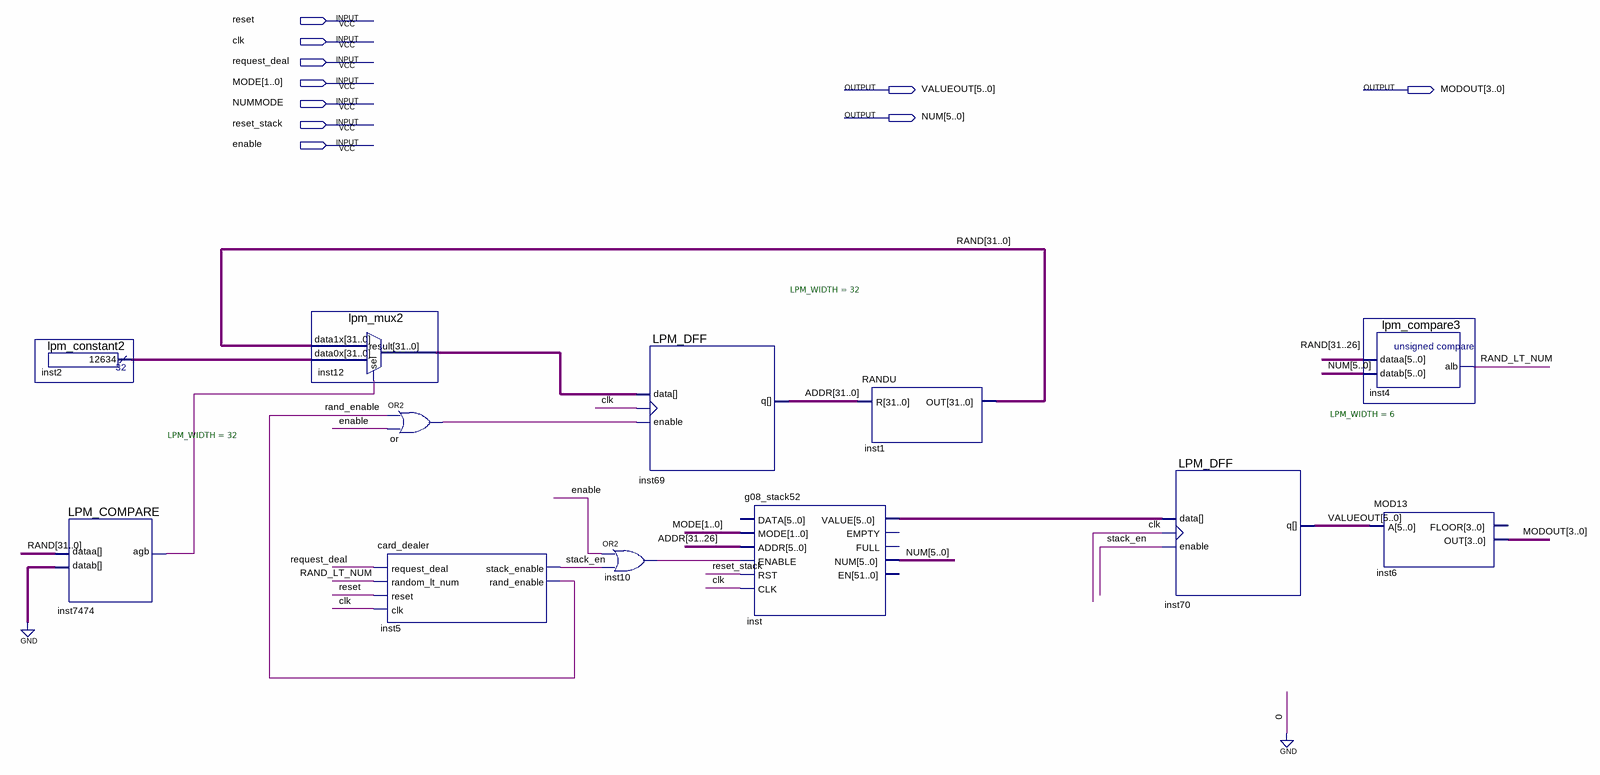
[diagram p0: schematic sheet]
// Quartus schematic test_bed_lab4.bdf as structural Verilog: 12 symbols, 10 pins
module test_bed_lab4 (
  input  reset,
  input  clk,
  input  request_deal,
  input  [1:0] MODE,
  input  NUMMODE,
  input  reset_stack,
  input  enable,
  output [5:0] VALUEOUT,
  output [3:0] MODOUT,
  output [5:0] NUM
);

  wire inst10_out, inst7474_agb, or_out, rand_enable, RAND_LT_NUM, stack_en;
  wire [5:0] inst_value;
  wire [31:0] ADDR, inst2_result, inst12_result, RAND;

  lpm_constant2 inst2 (.result(inst2_result));
  LPM_COMPARE #(.LPM_WIDTH(32)) inst7474 (.dataa(RAND), .datab({32{1'b0}}), .agb(inst7474_agb));
  lpm_mux2 inst12 (.data1x(RAND), .data0x(inst2_result), .sel(inst7474_agb), .result(inst12_result));
  or \or  (or_out, rand_enable, enable);
  card_dealer inst5 (
    .request_deal(request_deal), .random_lt_num(RAND_LT_NUM), .reset(reset), .clk(clk),
    .stack_enable(stack_en), .rand_enable(rand_enable));
  or inst10 (inst10_out, enable, stack_en);
  LPM_DFF #(.LPM_WIDTH(32)) inst69 (.enable(or_out), .clock(clk), .data(inst12_result), .q(ADDR));
  g08_stack52 inst (
    .MODE(MODE), .ADDR(ADDR[31:26]), .ENABLE(inst10_out), .RST(reset_stack), .CLK(clk), .VALUE(inst_value),
    .NUM(NUM));  // open: DATA, EMPTY, FULL, EN
  RANDU inst1 (.R(ADDR), .OUT(RAND));
  LPM_DFF #(.LPM_WIDTH(6)) inst70 (.enable(stack_en), .clock(clk), .data(inst_value), .q(VALUEOUT));
  lpm_compare3 inst4 (.dataa(RAND[31:26]), .datab(NUM), .alb(RAND_LT_NUM));
  MOD13 inst6 (.A(VALUEOUT), .OUT(MODOUT));  // open: FLOOR
endmodule
